# Altium schematic sheet USB-C_BENCH_PSU.SchDoc
size A3; SheetNumber: 1; SheetTotal: 1
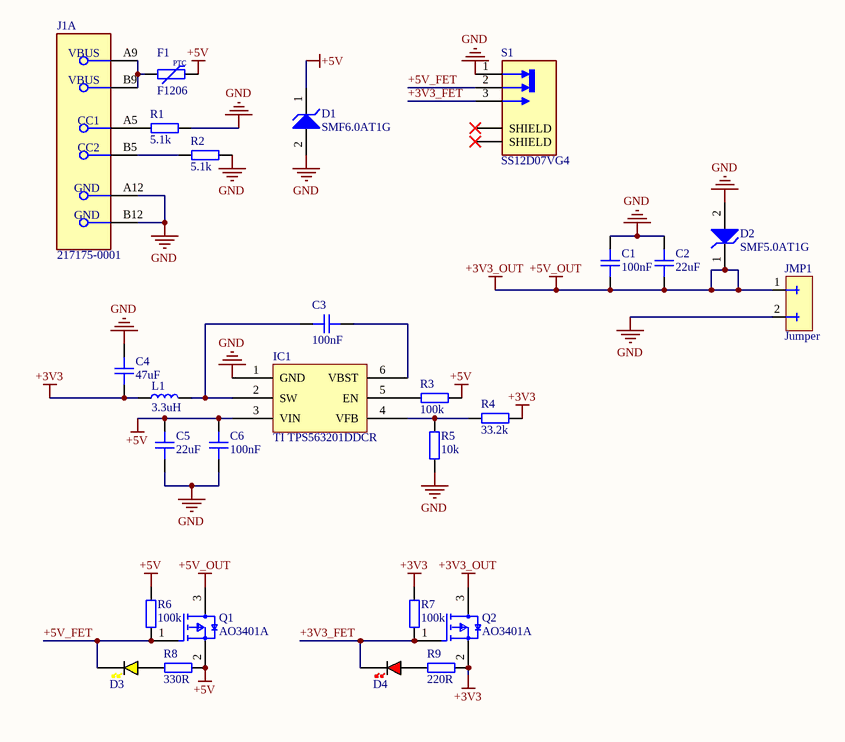
[diagram p0: USB-C_BENCH_PSU.SchDoc]

## Parts
C1  100nF  [CAP_0402]
C2  22uF  [CAP_0603]
C3  100nF  [CAP_0402]
C4  47uF  [CAP_0805]
C5  22uF  [CAP_0603]
C6  100nF  [CAP_0402]
D1  SMF6.0AT1G  [ONSC-SOD-123FL-2-498_V]
D2  SMF5.0AT1G  [ONSC-SOD-123FL-2-498_V]
D3  WHITE  [LED_0603_YELLOW]  (value not drawn)
D4  RED  [LED_0603_RED]  (value not drawn)
F1  F1206  [FUSE_1206]
IC1  TI TPS563201DDCR  [TI TPS563201DDCR]
J1  217175-0001  [FP-217175-0001-MFG]  (part A of 2)
JMP1  Jumper  [JMP2_TH]
L1  3.3uH  [IND_1008]
Q1  AO3401A  [FP-SOT23-IPC_B]
Q2  AO3401A  [FP-SOT23-IPC_B]
R1  5.1k  [RES_0402]
R2  5.1k  [RES_0402]
R3  100k  [RES_0402]
R4  33.2k  [RES_0402]
R5  10k  [RES_0402]
R6  100k  [RES_0402]
R7  100k  [RES_0402]
R8  330R  [RES_0402]
R9  220R  [RES_0402]
S1  SS12D07VG4  [SW_SS12D07VG4]

## Nets
+3V3: C4.1 L1.1 Q2.2(S) R4.2 R7.2 R9.2
+3V3_OUT: C1.1 C2.1 D2.1(K) JMP1.1 Q1.3(D) Q2.3(D)  [also labelled +5V_OUT]
+5V: C5.1 C6.1 D1.1(K) F1.2 IC1.3(VIN) Q1.2(S) R3.2 R6.2 R8.2
GND: C1.2 C2.2 C4.2 C5.2 C6.2 D1.2(A) D2.2(A) IC1.1(GND) J1.A12(GND) J1.B12(GND) JMP1.2 R1.2 R2.2 R5.1 S1.1
+3V3_FET: D4.K Q2.1(G) R7.1 S1.3
+5V_FET: D3.K Q1.1(G) R6.1 S1.2
NetC3_1: C3.1 IC1.6(VBST)
NetC3_2: C3.2 IC1.2(SW) L1.2
NetD3_A: D3.A R8.1
NetD4_A: D4.A R9.1
NetF1_1: F1.1 J1.A9(VBUS) J1.B9(VBUS)
NetIC1_4: IC1.4(VFB) R4.1 R5.2
NetIC1_5: IC1.5(EN) R3.1
NetJ1_A5: J1.A5(CC1) R1.1
NetJ1_B5: J1.B5(CC2) R2.1

Not connected (* = marked no-connect by the designer): S1 S1(SHIELD)* S2(SHIELD)*

## Notes on the sheet
- (in symbol FUSE_PPTC_1206) PTC

## Library data of the parts
C1 C3 C6 = CAP_0402: Capacitor SMD 0402; Manufacturer: *; Manufacturer Part Number: *; Distributor Link: *; LCSC: *; Rating: *; Dielectric: *
C2 C5 = CAP_0603: Capacitor SMD 0603; Manufacturer: *; Manufacturer Part Number: *; Distributor Link: *; LCSC: *; Rating: *; Dielectric: *
C4 = CAP_0805: Capacitor SMD 0805; Manufacturer: *; Manufacturer Part Number: *; Distributor Link: *; LCSC: *; Rating: *; Dielectric: *
D1 = CMP-1061-00612-1: 200 W Transient Voltage Suppressor, 2-Pin SOD-123FL, Pb-Free, Tape and Reel; PartNumber: SMF5.0AT1G; Manufacturer: On Semiconductor; Direction: Unidirectional; IR Max (uA): 400; V(BR) Typ (V): 6.7; PackageDescription: 2-Pin SOD, Body 1.65 x 2.7 mm; ComponentLink3Description: Package Specification; ComponentLink3URL: http://www.onsemi.com/pub_link/Collateral/498-01.PDF; PackageVersion: Rev. D, 05/2013; Mounting Technology: Surface Mount; PackageReference: SOD-123FL-2-498; ComponentLink2URL: http://www.onsemi.com/pub_link/Collateral/SMF5.0AT1-D.PDF; DatasheetVersion: Rev. 7; ComponentLink1Description: Manufacturer URL; Packing: Tape and Reel; RoHS: Pb-Free; ComponentLink1URL: http://www.onsemi.com/; ComponentLink2Description: Datasheet
D2 = CMP-1061-00612-1: 200 W Transient Voltage Suppressor, 2-Pin SOD-123FL, Pb-Free, Tape and Reel; Manufacturer: On Semiconductor; Direction: Unidirectional; IR Max (uA): 400; V(BR) Typ (V): 6.7; PackageDescription: 2-Pin SOD, Body 1.65 x 2.7 mm; PartNumber: SMF5.0AT1G; ComponentLink3Description: Package Specification; ComponentLink3URL: http://www.onsemi.com/pub_link/Collateral/498-01.PDF; PackageVersion: Rev. D, 05/2013; Mounting Technology: Surface Mount; PackageReference: SOD-123FL-2-498; ComponentLink2URL: http://www.onsemi.com/pub_link/Collateral/SMF5.0AT1-D.PDF; DatasheetVersion: Rev. 7; ComponentLink1Description: Manufacturer URL; Packing: Tape and Reel; RoHS: Pb-Free; ComponentLink1URL: http://www.onsemi.com/; ComponentLink2Description: Datasheet
D3 = LED_0603_YELLOW: LED 0603 WHITE SMD
D4 = LED_0603_RED: LED 0603 RED SMD
F1 = FUSE_PPTC_1206: Fuse PPTC SMD 1206; Manufacturer: *; Manufacturer Part Number: *
J1 = CMP-04767-000026-1: CONN RCP USB2.0 C 6+18P SMD RA
JMP1 = JMP2_TH: Jumper 2 Pins Through-Hole DO NOT PLACE
L1 = IND_1008: Inductor SMD 1008
Q1 Q2 = CMP-12801-000062-2: MOSFET P-CH 30V SOT23; Gate to Source Voltage (Vgs): 20V; Turn-Off Delay Time: 31ns; Drain to Source Voltage (Vdss): -30V; Fall Time: 15ns; Threshold Voltage: -2.1V; Rise Time: 5ns; Input Capacitance: 563pF; Number of Channels: 1; Drain to Source Resistance: 65mR; Element Configuration: Single; Max Power Dissipation: 1.08W; Turn-On Delay Time: 4.8ns; Continuous Drain Current (ID): 3.8A; Lead Free: Lead Free; Number of Pins: 3; Package Quantity: 3000; Width: 1.4mm; Radiation Hardening: No; Mount: Surface Mount; Case/Package: SOT-23; Contact Plating: Tin; Rds On Max: 65mR; Height: 1.1mm; REACH SVHC: No SVHC; Weight: 0.000282oz; Max Operating Temperature: 150°C; Packaging: Tape and Reel; Min Operating Temperature: -55°C; Length: 3mm
R1-R9 = RES_0402: Resistor SMD 0402; Manufacturer: *; Manufacturer Part Number: *; Distributor Link: *; LCSC: *
S1 = SS12D07VG4: Switch Slide ON ON SPDT Top Slide 0.3A 30VDC PC Pins Bracket Mount/Through Hole Automotive Bulk; MF: Shouhan; SnapEDA_Link: https://www.snapeda.com/parts/SS12D07VG4/Shouhan/view-part/?ref=snap; Package: Package; Value: *; MP: SS12D07VG4; Check_prices: https://www.snapeda.com/parts/SS12D07VG4/Shouhan/view-part/?ref=eda